# Altium schematic sheet IRSM005-301MHIRSM005-301MH.schdoc
size 127 x 101 mm
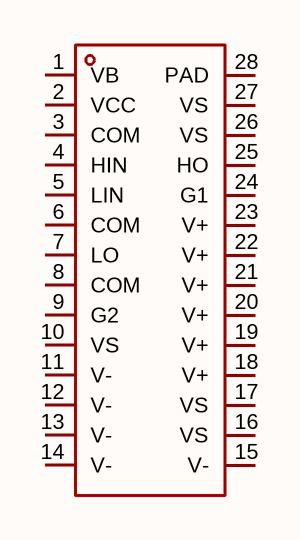
[diagram p0: IRSM005-301MHIRSM005-301MH.schdoc]

## Parts
U?  (no value)

## Nets

Not connected (* = marked no-connect by the designer): U? 1(VB) 2(VCC) 3(COM) 4(HIN) 5(LIN) 6(COM) 7(LO) 8(COM) 9(G2) 10(VS) 11(V-) 12(V-) 13(V-) 14(V-) 15(V-) 16(VS) 17(VS) 18(V+) 19(V+) 20(V+) 21(V+) 22(V+) 23(V+) 24(G1) 25(HO) 26(VS) 27(VS) 28(PAD)

## Library data of the parts
U? = IRSM005-301MH: Symbol: IRSM005-301MH